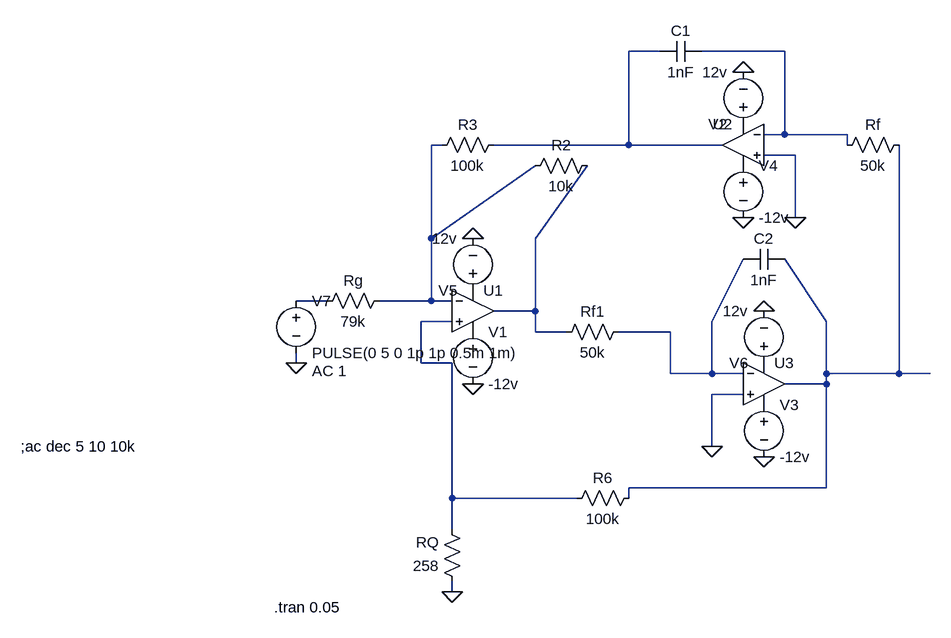
[diagram p0: schematic Band-Pass1.asc]
Band-Pass1.asc, the LTspice schematic file:
Version 4
SHEET 1 1472 680
WIRE 512 -256 464 -256
WIRE 704 -256 576 -256
WIRE 704 -128 704 -256
WIRE 704 -128 672 -128
WIRE 800 -128 704 -128
WIRE 176 -112 160 -112
WIRE 464 -112 464 -256
WIRE 464 -112 256 -112
WIRE 608 -112 464 -112
WIRE 800 -112 800 -128
WIRE 720 -96 672 -96
WIRE 720 0 720 -96
WIRE 160 32 160 -112
WIRE 160 32 320 -80
WIRE 320 32 400 -80
WIRE 0 128 -48 128
WIRE 160 128 160 32
WIRE 160 128 80 128
WIRE 192 128 160 128
WIRE 320 144 320 32
WIRE 320 144 256 144
WIRE 192 160 144 160
WIRE 592 160 640 64
WIRE 768 160 704 64
WIRE 320 176 320 144
WIRE 368 176 320 176
WIRE 528 176 448 176
WIRE -48 224 -48 208
WIRE 144 224 144 160
WIRE 192 224 144 224
WIRE 528 240 528 176
WIRE 592 240 592 160
WIRE 592 240 528 240
WIRE 640 240 592 240
WIRE 768 240 768 160
WIRE 880 240 880 -112
WIRE 880 240 768 240
WIRE 928 240 880 240
WIRE 768 256 768 240
WIRE 768 256 704 256
WIRE 640 272 592 272
WIRE 592 352 592 272
WIRE 768 416 768 256
WIRE 768 416 464 416
WIRE 192 432 192 224
WIRE 384 432 192 432
WIRE 464 432 464 416
WIRE 192 480 192 432
WIRE 192 576 192 560
FLAG 592 352 0
FLAG 192 576 0
FLAG 720 0 0
FLAG 640 -224 0
FLAG 224 256 0
FLAG 672 368 0
FLAG 640 0 0
FLAG 224 32 0
FLAG 672 144 0
FLAG -48 224 0
SYMBOL res 96 112 R90
WINDOW 0 0 56 VBottom 2
WINDOW 3 32 56 VTop 2
SYMATTR InstName Rg
SYMATTR Value 79k
SYMBOL res 416 -96 R90
WINDOW 0 0 56 VBottom 2
WINDOW 3 32 56 VTop 2
SYMATTR InstName R2
SYMATTR Value 10k
SYMBOL Opamps\\UniversalOpamp2 224 144 R0
SYMATTR InstName U1
SYMBOL Opamps\\UniversalOpamp2 640 -112 M0
SYMATTR InstName U2
SYMBOL Opamps\\UniversalOpamp2 672 256 R0
SYMATTR InstName U3
SYMBOL res 272 -128 R90
WINDOW 0 0 56 VBottom 2
WINDOW 3 32 56 VTop 2
SYMATTR InstName R3
SYMATTR Value 100k
SYMBOL cap 576 -272 R90
WINDOW 0 0 32 VBottom 2
WINDOW 3 32 32 VTop 2
SYMATTR InstName C1
SYMATTR Value 1nF
SYMBOL cap 704 48 R90
WINDOW 0 0 32 VBottom 2
WINDOW 3 32 32 VTop 2
SYMATTR InstName C2
SYMATTR Value 1nF
SYMBOL res 464 160 R90
WINDOW 0 0 56 VBottom 2
WINDOW 3 32 56 VTop 2
SYMATTR InstName Rf1
SYMATTR Value 50k
SYMBOL res 208 576 R180
WINDOW 0 36 76 Left 2
WINDOW 3 36 40 Left 2
SYMATTR InstName RQ
SYMATTR Value 258
SYMBOL res 368 448 R270
WINDOW 0 32 56 VTop 2
WINDOW 3 0 56 VBottom 2
SYMATTR InstName R6
SYMATTR Value 100k
SYMBOL res 784 -96 R270
WINDOW 0 32 56 VTop 2
WINDOW 3 0 56 VBottom 2
SYMATTR InstName Rf
SYMATTR Value 50k
SYMBOL voltage 224 160 R0
WINDOW 123 0 0 Left 2
WINDOW 39 0 0 Left 2
SYMATTR InstName V1
SYMATTR Value -12v
SYMBOL voltage 640 -128 R180
WINDOW 123 0 0 Left 2
WINDOW 39 0 0 Left 2
SYMATTR InstName V2
SYMATTR Value 12v
SYMBOL voltage 672 272 R0
WINDOW 123 0 0 Left 2
WINDOW 39 0 0 Left 2
SYMATTR InstName V3
SYMATTR Value -12v
SYMBOL voltage 640 -96 R0
WINDOW 123 0 0 Left 2
WINDOW 39 0 0 Left 2
SYMATTR InstName V4
SYMATTR Value -12v
SYMBOL voltage 224 128 R180
WINDOW 123 0 0 Left 2
WINDOW 39 0 0 Left 2
SYMATTR InstName V5
SYMATTR Value 12v
SYMBOL voltage 672 240 R180
WINDOW 123 0 0 Left 2
WINDOW 39 0 0 Left 2
SYMATTR InstName V6
SYMATTR Value 12v
SYMBOL voltage -48 112 R0
WINDOW 123 24 124 Left 2
WINDOW 39 0 0 Left 2
SYMATTR InstName V7
SYMATTR Value PULSE(0 5 0 1p 1p 0.5m 1m)
SYMATTR Value2 AC 1
TEXT -82 600 Left 2 !.tran 0.05
TEXT -472 352 Left 2 !;ac dec 5 10 10k

The netlist it stands for:
* Band-Pass1.asc
Rg N003 N005 79k
R2 N004 N003 10k
XU1 N006 N003 P001 P002 N004 level.2 Avol=1Meg GBW=10Meg Slew=10Meg ilimit=25m rail=0 Vos=0 phimargin=45 en=0 enk=0 in=0 ink=0 Rin=500Meg  ; pins IN+ IN- V+ V- OUT
XU2 0 N002 P003 P004 N001 level.2 Avol=1Meg GBW=10Meg Slew=10Meg ilimit=25m rail=0 Vos=0 phimargin=45 en=0 enk=0 in=0 ink=0 Rin=500Meg  ; pins IN+ IN- V+ V- OUT
XU3 0 N007 P005 P006 N008 level.2 Avol=1Meg GBW=10Meg Slew=10Meg ilimit=25m rail=0 Vos=0 phimargin=45 en=0 enk=0 in=0 ink=0 Rin=500Meg  ; pins IN+ IN- V+ V- OUT
R3 N001 N003 100k
C1 N002 N001 1nF
C2 N008 N007 1nF
Rf1 N007 N004 50k
RQ 0 N006 258
R6 N006 N008 100k
Rf N002 N008 50k
V1 P002 0 -12v
V2 P003 0 12v
V3 P006 0 -12v
V4 P004 0 -12v
V5 P001 0 12v
V6 P005 0 12v
V7 N005 0 PULSE(0 5 0 1p 1p 0.5m 1m) AC 1
.tran 0.05
;ac dec 5 10 10k
.lib UniversalOpamps2.sub
.backanno
.end